# Altium schematic sheet Sheet1.SchDoc
size A; SheetNumber: 1; SheetTotal: 1
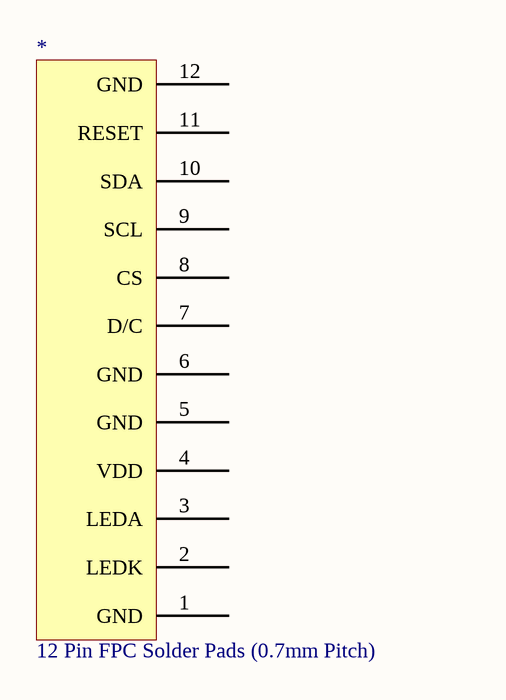
[diagram p0: Sheet1.SchDoc]

## Parts
*  12 Pin FPC Solder Pads (0.7mm Pitch)  [12Pin_07Pitch_FPC]

## Nets

Not connected (* = marked no-connect by the designer): * 1(GND) 2(LEDK) 3(LEDA) 4(VDD) 5(GND) 6(GND) 7(D/C) 8(CS) 9(SCL) 10(SDA) 11(RESET) 12(GND)